# EAGLE design CS43L22-CNZ_withoutAnalog (EAGLE 9.2.0)
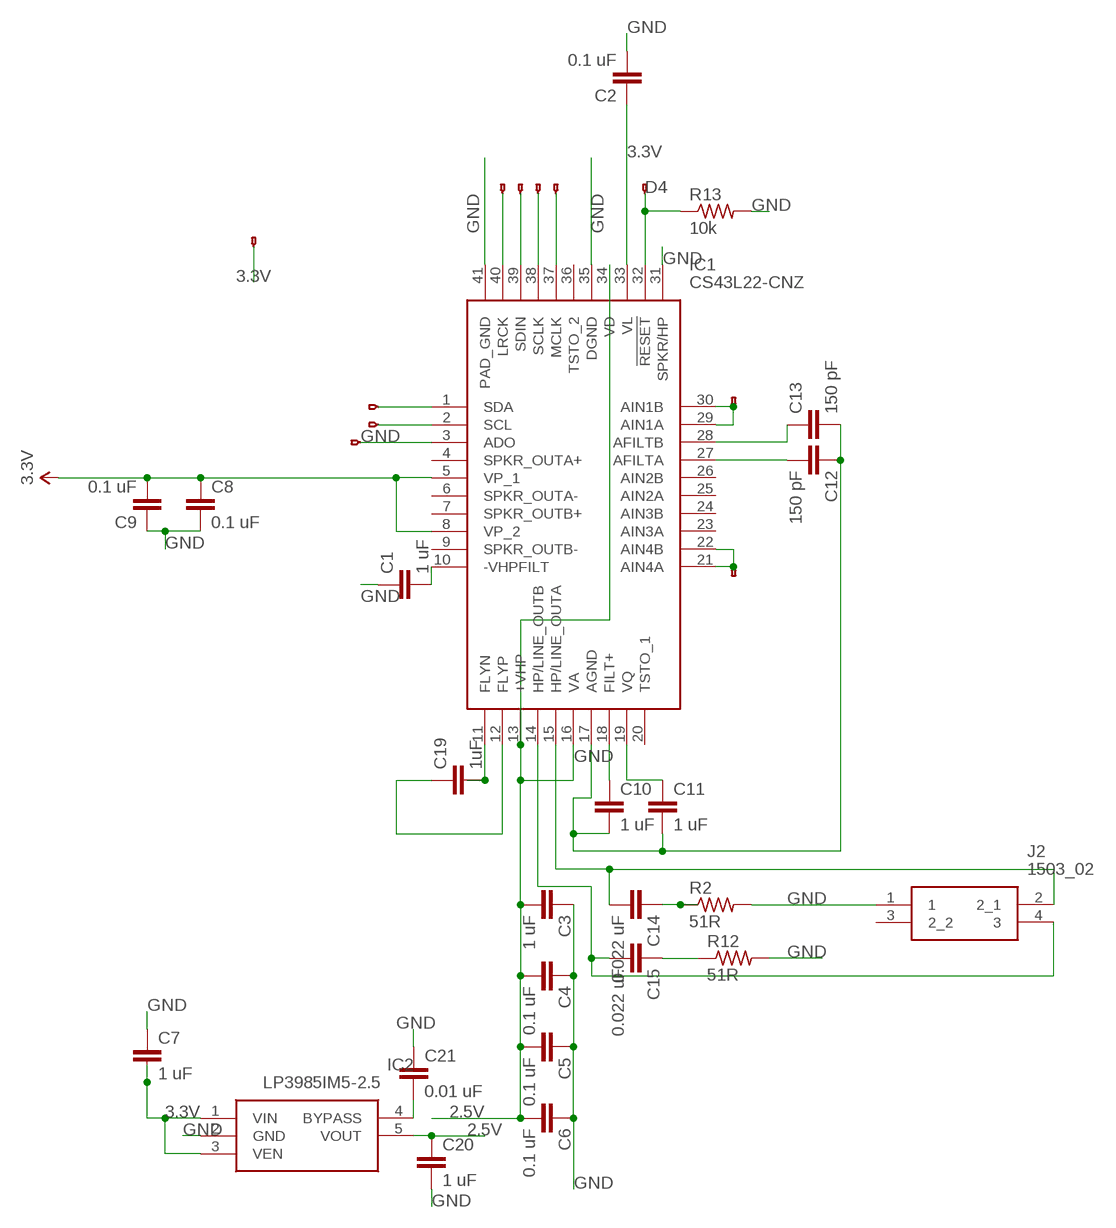
[diagram p0: schematic, sheet 1]

## Parts
C1  1 uF  CAPKIT  [CAP-PTH-SMALL-KIT]
C2  0.1 uF  CAPKIT  [CAP-PTH-SMALL-KIT]
C3  1 uF  CAPKIT  [CAP-PTH-SMALL-KIT]
C4  0.1 uF  CAPKIT  [CAP-PTH-SMALL-KIT]
C5  0.1 uF  CAPKIT  [CAP-PTH-SMALL-KIT]
C6  0.1 uF  CAPKIT  [CAP-PTH-SMALL-KIT]
C7  1 uF  CAPKIT  [CAP-PTH-SMALL-KIT]
C8  0.1 uF  CAPKIT  [CAP-PTH-SMALL-KIT]
C9  0.1 uF  CAPKIT  [CAP-PTH-SMALL-KIT]
C10  1 uF  CAPKIT  [CAP-PTH-SMALL-KIT]
C11  1 uF  CAPKIT  [CAP-PTH-SMALL-KIT]
C12  150 pF  CAPKIT  [CAP-PTH-SMALL-KIT]
C13  150 pF  CAPKIT  [CAP-PTH-SMALL-KIT]
C14  0.022 uF  CAPKIT  [CAP-PTH-SMALL-KIT]
C15  0.022 uF  CAPKIT  [CAP-PTH-SMALL-KIT]
C19  1uF  C2,5-3  [C2.5-3]
C20  1 uF  CAPKIT  [CAP-PTH-SMALL-KIT]
C21  0.01 uF  CAPKIT  [CAP-PTH-SMALL-KIT]
IC1  CS43L22-CNZ  [QFN50P600X600X100-41N]
IC2  LP3985IM5-2.5  [SOT95P300X120-5N]
J2  1503_02  [150302]
JP1  HEADERHOLE-HEADERHOLE  [1X1-HEADER-HOLE]
JP2  HEADERHOLE-HEADERHOLE  [1X1-HEADER-HOLE]
JP3  HEADERHOLE-HEADERHOLE  [1X1-HEADER-HOLE]
JP4  HEADERHOLE-HEADERHOLE  [1X1-HEADER-HOLE]
JP5  HEADERHOLE-HEADERHOLE  [1X1-HEADER-HOLE]
JP6  HEADERHOLE-HEADERHOLE  [1X1-HEADER-HOLE]
JP7  HEADERHOLE-HEADERHOLE  [1X1-HEADER-HOLE]
JP8  HEADERHOLE-HEADERHOLE  [1X1-HEADER-HOLE]
JP9  HEADERHOLE-HEADERHOLE  [1X1-HEADER-HOLE]
JP18  HEADERHOLE-HEADERHOLE  [1X1-HEADER-HOLE]
JP19  HEADERHOLE-HEADERHOLE  [1X1-HEADER-HOLE]
R2  51R  R-US_0204/2V  [0204V]
R12  51R  R-US_0204/2V  [0204V]
R13  10k  R-US_0204/2V  [0204V]

## Nets
2.5V: C3.2 C4.2 C5.2 C6.2 C20.1 IC1.13(+VHP) IC1.16(VA) IC1.34(VD) IC2.5(VOUT)
3.3V: C2.1 C7.2 C8.1 C9.2 IC1.5(VP_1) IC1.8(VP_2) IC1.33(VL) IC2.1(VIN) IC2.3(VEN) JP8.1
D4: IC1.32(!RESET) JP7.1 R13.1
GND: C1.1 C2.2 C3.1 C4.1 C5.1 C6.1 C7.1 C8.2 C9.1 C10.2 C11.2 C12.1 C13.2 C20.2 C21.1 IC1.3(ADO) IC1.17(AGND) IC1.31(SPKR/HP) IC1.35(DGND) IC1.41(PAD_GND) IC2.2(GND) J2.1 JP9.1 R2.2 R12.2 R13.2
N$1: C19.2 IC1.11(FLYN)
N$2: IC1.1(SDA) JP1.1
N$3: IC1.2(SCL) JP2.1
N$4: IC1.37(MCLK) JP3.1
N$5: IC1.38(SCLK) JP4.1
N$6: IC1.39(SDIN) JP5.1
N$7: IC1.40(LRCK) JP6.1
N$8: C21.2 IC2.4(BYPASS)
N$9: C1.2 IC1.10(-VHPFILT)
N$10: C19.1 IC1.12(FLYP)
N$11: C11.1 IC1.19(VQ)
N$13: C12.2 IC1.27(AFILTA)
N$14: C13.1 IC1.28(AFILTB)
N$15: C14.2 IC1.15(HP/LINE_OUTA) J2.2(2_1)
N$16: C10.1 IC1.18(FILT+)
N$17: C15.2 IC1.14(HP/LINE_OUTB) J2.4
N$18: C14.1 R2.1
N$19: C15.1 R12.1
N$31: IC1.29(AIN1A) IC1.30(AIN1B) JP19.1
N$32: IC1.21(AIN4A) IC1.22(AIN4B) JP18.1
Unconnected: IC1.4(SPKR_OUTA+) IC1.6(SPKR_OUTA-) IC1.7(SPKR_OUTB+) IC1.9(SPKR_OUTB-) IC1.20(TSTO_1) IC1.23(AIN3A) IC1.24(AIN3B) IC1.25(AIN2A) IC1.26(AIN2B) IC1.36(TSTO_2) J2.3(2_2)

## Library data of the parts
C1-C15 C20 C21 = F405Pill:CAP: Capacitor Standard 0603 ceramic capacitor, and 0.1" leaded capacitor.
C19 = capacitor-wima:C: CAPACITOR naming: grid - package width
IC1 = CS43L22-CNZ:CS43L22-CNZ: CS43L22-CNZ, Audio DAC 24 bit-, 96ksps Serial, 40-Pin QFN Source: Datasheet <https://d3uzseaevmutz1.cloudfront.net/pubs/proDatasheet/CS43L22_F2.pdf>; DESCRIPTION: CS43L22-CNZ, Audio DAC 24 bit-, 96ksps Serial, 40-Pin QFN; HEIGHT: 1mm; MANUFACTURER_NAME: Cirrus Logic; MANUFACTURER_PART_NUMBER: CS43L22-CNZ; MOUSER_PART_NUMBER: 777-CS43L22-CNZ; MOUSER_PRICE-STOCK: https://www.mouser.com/Search/Refine.aspx?Keyword=777-CS43L22-CNZ; RS_PART_NUMBER: 7165851P; RS_PRICE-STOCK: http://uk.rs-online.com/web/p/products/7165851P
IC2 = LP3985IM5-2.5:LP3985IM5-2.5: Low-Dropout CMOS Voltage Regulator Source: Datasheet; DESCRIPTION: Low-Dropout CMOS Voltage Regulator; HEIGHT: mm; MANUFACTURER_NAME: Texas Instruments; MANUFACTURER_PART_NUMBER: LP3985IM5-2.5; MOUSER_PART_NUMBER: 926-LP3985IM5-25; MOUSER_PRICE-STOCK: https://www.mouser.com/Search/Refine.aspx?Keyword=926-LP3985IM5-25; RS_PART_NUMBER: 4433167; RS_PRICE-STOCK: https://uk.rs-online.com/web/p/products/4433167
J2 = 1503_02:1503_02: LUMBERG - 1503 02 - CONNECTOR, RECEPTACLE, 3.5MM PHONO, 3WAY Source: Datasheet <http://www.farnell.com/datasheets/2047485.pdf>; DESCRIPTION: LUMBERG - 1503 02 - CONNECTOR, RECEPTACLE, 3.5MM PHONO, 3WAY; HEIGHT: 5mm; MANUFACTURER_NAME: LUMBERG; MANUFACTURER_PART_NUMBER: 1503 02
JP1-JP9 JP18 JP19 = F405Pill:HEADERHOLE
R2 R12 R13 = rcl:R-US_: RESISTOR, American symbol; SPICEPREFIX: R

## Net classes
0 default: width 0.254 mm, drill 0.35 mm
1 ground: width 0.254 mm, drill 0.35 mm

## Board
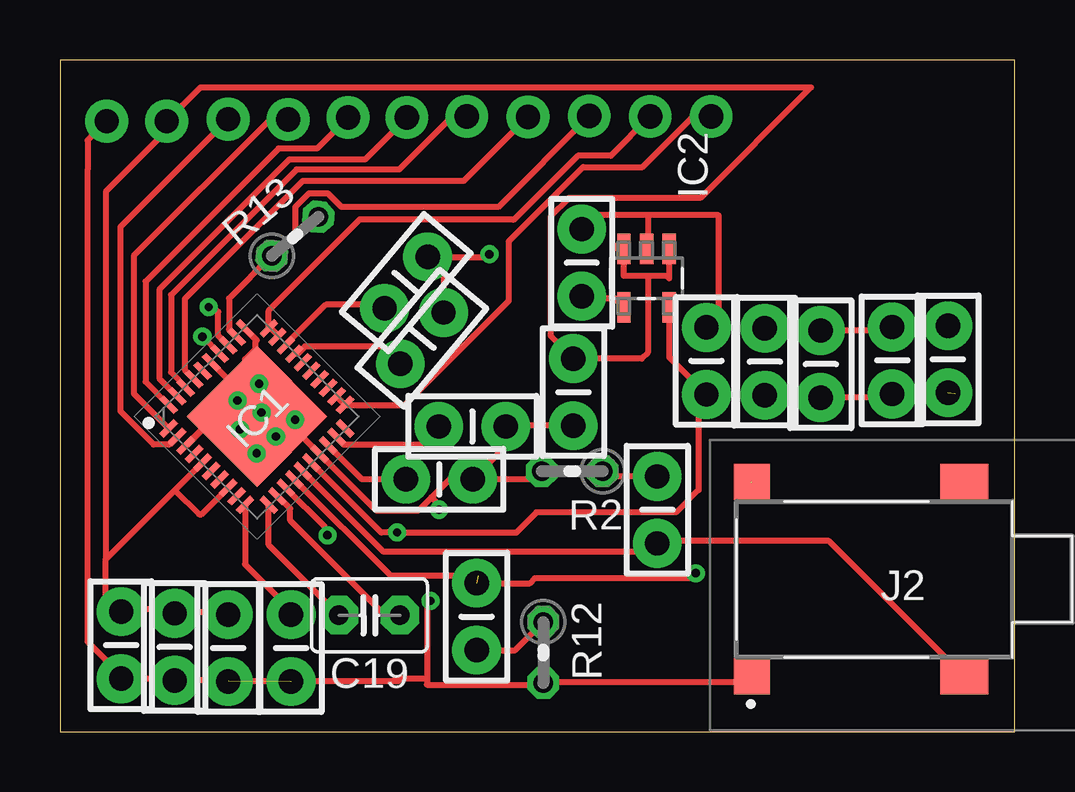
[diagram p1: board, top side]
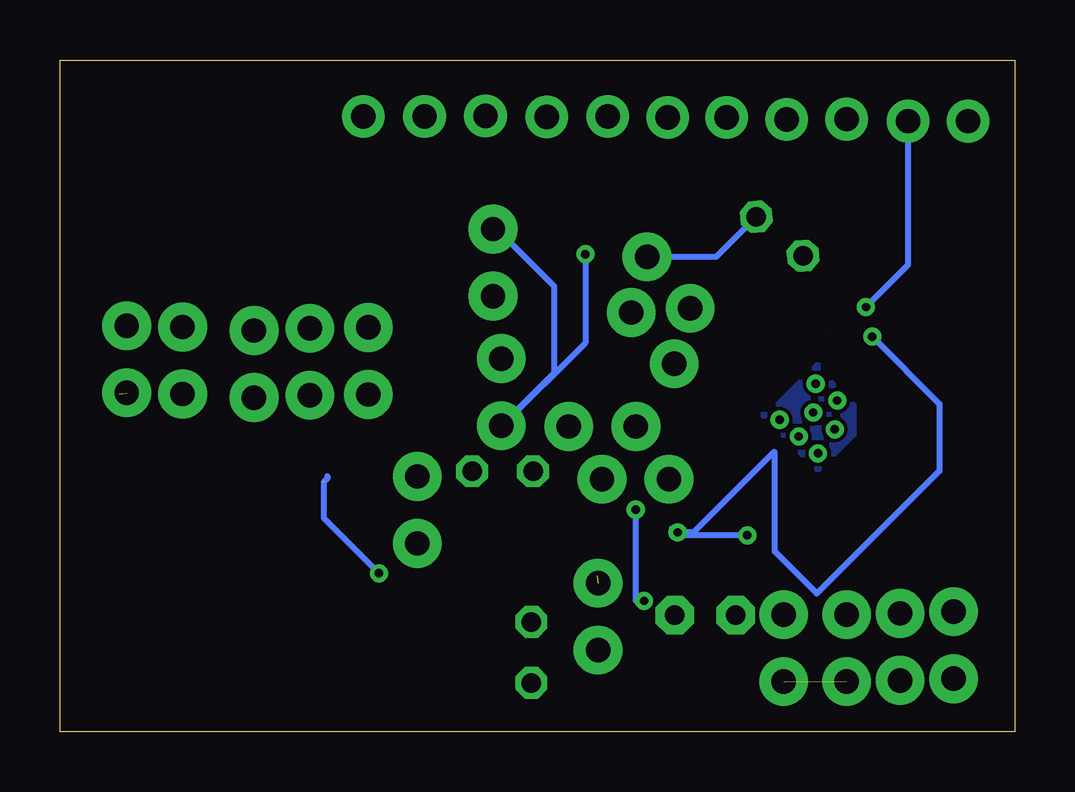
[diagram p2: board, bottom side, seen from below]

Size 39.8 x 28 mm. Coordinates in mm from the lower left corner, seen from the top.
Outline: 0,0 39.8,0 39.8,28 0,28 0,0
Copper layers (1*16): Top 0.035mm / dielectric 1.5mm / Bottom 0.035mm
Design rules "default": minimum track width 6mil, minimum drill 0.35mm, track to track 6mil, track to pad 6mil, pad to pad 6mil, via to via 6mil, smd to smd 6mil, copper to edge 40mil, drill to drill 6mil, minimum pad ring 10mil, minimum via ring 8mil, stop-mask expansion 4mil, vias tented up to drill 0mil, thermal gap 10mil

### Footprints (pad centres in the part's own frame; a part is rotated, then mirrored left to right if it is on the bottom)
CAP-PTH-SMALL-KIT = drill 1.016 pad 2.032: 1 -1.397,0; 2 1.397,0
C2.5-3 = drill 0.813 pad 1.6 octagon: 1 -1.27,0; 2 1.27,0
QFN50P600X600X100-41N = smd 0.85 x 0.25: 1 -2.95,2.25; 2 -2.95,1.75; 3 -2.95,1.25; 4 -2.95,0.75; 5 -2.95,0.25; 6 -2.95,-0.25; 7 -2.95,-0.75; 8 -2.95,-1.25; 9 -2.95,-1.75; 10 -2.95,-2.25; 21 2.95,-2.25; 22 2.95,-1.75; 23 2.95,-1.25; 24 2.95,-0.75; 25 2.95,-0.25; 26 2.95,0.25; 27 2.95,0.75; 28 2.95,1.25; 29 2.95,1.75; 30 2.95,2.25 | smd 0.25 x 0.85: 11 -2.25,-2.95; 12 -1.75,-2.95; 13 -1.25,-2.95; 14 -0.75,-2.95; 15 -0.25,-2.95; 16 0.25,-2.95; 17 0.75,-2.95; 18 1.25,-2.95; 19 1.75,-2.95; 20 2.25,-2.95; 31 2.25,2.95; 32 1.75,2.95; 33 1.25,2.95; 34 0.75,2.95; 35 0.25,2.95; 36 -0.25,2.95; 37 -0.75,2.95; 38 -1.25,2.95; 39 -1.75,2.95; 40 -2.25,2.95 | smd 4.15 x 4.15: 41 0,0
SOT95P300X120-5N = smd 1.27 x 0.559: 1 -1.219,0.94; 2 -1.219,0; 3 -1.219,-0.94; 4 1.219,-0.94; 5 1.219,0.94
150302 = smd 1.5 x 1.5: 1 6.3,3.8; 4 6.3,-4.3 | smd 2 x 1.5: 2 -2.55,3.8; 3 -2.55,-4.3
1X1-HEADER-HOLE = drill 1.016 pad 1.778: 1 0,0
0204V = drill 0.813 octagon: 1 -1.27,0; 2 1.27,0

### Placement (x,y rotation side)
C1  9.63,3.48 90 top
C2  2.55,3.6 270 top
C3  37.02,15.52 270 top
C4  34.69,15.47 270 top
C5  31.71,15.32 270 top
C6  29.38,15.42 270 top
C7  21.4,14.15 90 top
C8  4.78,3.53 270 top
C9  7.01,3.48 90 top
C10  15.81,10.52 0 top
C11  17.19,12.72 0 top
C12  15.09,16.4 230 top
C13  14.43,18.72 50 top
C14  24.9,9.24 270 top
C15  17.37,4.79 90 top
C19  12.9,4.85 180 top
C20  26.95,15.45 90 top
C21  21.75,19.55 270 top
IC1  8.21,13.13 45 top
IC2  24.45,18.9 270 top
J2  35.15,6.1 180 top
JP1  9.51,25.52 0 top
JP2  7.01,25.53 0 top
JP3  19.51,25.63 0 top
JP4  16.96,25.64 0 top
JP5  14.46,25.6 0 top
JP6  12.01,25.61 0 top
JP7  22.06,25.66 0 top
JP8  4.45,25.45 0 top
JP9  1.95,25.45 0 top
JP18  27.15,25.65 0 top
JP19  24.6,25.65 0 top
R2  21.35,10.85 180 top
R12  20.15,3.3 270 top
R13  9.8,20.65 40 top

### Tracks (layer width: path | path; a pad name or v marks a point on that pad's centre or on a via)
2.5V  (via drill 0.35)  (1 unrouted)
  Top 0.254: IC1.13 11.05,8.52 11.05,8.08 v11.15,8.18 | IC1.16 13.39,8.3 v14.05,8.3 19.03,8.3 19.86,9.14 25.69,9.14 26.61,10.06 26.61,13.72 C20.1 | C20.1 29.35,14.05 C6.2 31.61,14.02 C5.2 34.54,13.92 C4.2 37.33,14.07 37.5,13.9 | C20.1 25.39,15.61 IC2.5 | IC1.34 v5.94,16.46
  Bottom 0.254: v11.15,8.18 14.03,8.18 14.15,8.3 | 14.3,8.45 14.15,8.3 | 14.15,8.3 v14.05,8.3 13.4,8.3 10.05,11.65 10,11.65 10,7.5 8.25,5.75 3.14,10.86 3.14,13.66 v5.94,16.46
3.3V  (via drill 0.35)
  Top 0.254: 23.11,20.25 23.38,20.25 23.25,20.12 IC2.3 23.5,19 24.5,19 | 5.95,11.2 IC1.5 4.79,10.06 | IC1.8 5.9,9.05 5.8,9.05 4.79,10.06 | C9.2 6.91,4.98 4.8,4.98 | 4.8,4.98 4.78,4.96 C8.1 | 5.05,5.2 C8.1 | IC1.33 6.6,16.51 6.6,17.5 6.4,17.7 v6.2,17.7 | 4.95,5.1 C8.1 | 4.8,4.98 4.68,5.1 2.65,5.1 C2.1 1.89,5.66 1.89,7.16 1.91,7.18 | 1.91,7.18 4.79,10.06 | 1.91,7.18 1.91,22.51 4.45,25.05 JP8.1 5.86,26.86 31.31,26.86 26.7,22.24 21.21,22.24 20.45,21.48 20.45,16.49 C7.2 24.25,15.55 24.5,15.8 24.5,19 | IC2.1 25.39,18.91 | 25.39,18.91 25.4,18.9 | 25.39,18.91 25.3,19 24.5,19
  Bottom 0.254: v6.2,17.7 4.45,19.45 JP8.1
D4
  Top 0.254: JP7.1 18.27,21.87 11.74,21.87 11.18,22.44 10.37,22.44 9.8,21.87 9.8,20.81 R13.1 7.05,18.05 7.05,16.77 IC1.32
GND  (via drill 0.35)  (2 unrouted)
  Top 0.254: 1.95,25.3 JP9.1 1.15,24.65 1.15,23.43 1.14,23.42 1.14,3.76 2.7,2.2 | C3.1 36.97,16.87 C4.1 34.54,16.72 C5.1 31.61,16.82 C6.1 26.98,16.82 C20.2 27.45,17.35 27.45,21.53 24.5,21.53 | 24.5,21.53 24.5,20.17 IC2.2 | 24.5,21.53 22.32,21.53 C21.1 | 17.24,10.56 18.59,11.9 C11.2 18.62,12.75 C7.1 | 17.24,10.56 C10.2 19.75,10.52 R2.2 | C12.1 15.99,19.13 C13.2 18.01,19.79 v17.9,19.9 | 4.9,2.13 6.96,2.13 C9.1 7.03,2.1 14.1,2.1 14,2.2 15.3,2.2 | 4.9,2.13 C8.2 | J2.1 28.6,2.05 20.17,2.05 R12.2 20.23,1.95 15.3,1.95 15.3,2.2 | 17.24,10.56 16.28,10.56 15.49,9.76 | 15.49,9.76 14.95,9.22 13.18,9.22 IC1.17 9.27,13.13 IC1.41 | 6.19,12.84 5.28,11.93 IC1.3 6.44,13.13 IC1.41 | 8.21,16.31 7.72,16.8 | 15.49,9.76 15.8,9.45 v15.8,9.25 | v15.45,5.45 15.3,5.3 15.3,2.2 | 2.7,2.2 4.83,2.2 4.9,2.13 | 2.7,2.2 C2.2 | IC1.35 8.21,13.48 IC1.41 | IC1.41 8.2,14.4 7.71,14.88 7.71,15.51 8.13,15.93 8.13,16.36 7.71,16.77 IC1.31
  Bottom 0.254: v17.9,19.9 17.9,16.2 21.35,12.75 C7.1 19.2,14.95 19.2,18.57 21.58,20.95 C21.1 | R13.2 12.45,19.79 C13.2 | v15.8,9.25 15.8,5.45 v15.45,5.45
HEAT
  pour Bottom: 8.2,15.3 10.3,13.2 10.5,13.2 8.2,10.9 6.7,12.4 6.7,13.6 8.2,15.1
N$1
  Top 0.254: C19.2 8.71,7.78 IC1.11
N$2
  Top 0.254: IC1.1 3.08,14.09 3.08,19.84 8.76,25.52 JP1.1
N$3
  Top 0.254: IC1.2 4.85,12.28 4.54,11.97 3.9,11.97 2.52,13.36 2.52,21.04 JP2.1
N$4
  Top 0.254: JP3.1 16.83,22.95 10.12,22.95 5.2,18.03 5.2,15.08 IC1.37
N$5
  Top 0.254: JP4.1 16.35,25.64 14.14,23.43 9.86,23.43 4.62,18.2 4.62,14.98 5.24,14.37 IC1.38
N$6
  Top 0.254: IC1.39 4.14,14.73 4.14,18.43 9.56,23.85 12.71,23.85 JP5.1
N$7
  Top 0.254: IC1.40 4.52,13.62 3.57,14.57 3.57,18.77 9.11,24.31 10.71,24.31 JP6.1
N$8
  Top 0.254: C21.2 21.85,18.05 23.14,18.05 IC2.4
N$9
  Top 0.254: IC1.10 7.71,6.97 9.63,5.05 C1.2
N$10
  Top 0.254: C19.1 13.55,4.85 9.6,8.8 9.6,9.3 9.09,9.81 | 9.09,9.81 | 9.09,9.81 IC1.12
N$11
  Top 0.254: IC1.19 11.53,12.27 11.83,11.97 15.04,11.97 C11.1
N$12  (via drill 0.35)
  other vias: 8.3,14.5
N$13
  Top 0.254: C12.2 13.46,16.06 10.22,16.06 9.9,15.75 IC1.27
N$14
  Top 0.254: C13.1 13.38,17.8 11.08,17.8 9.41,16.13 IC1.28
N$15
  Top 0.254: IC1.15 13.49,7.49 24.55,7.49 C14.2 25,7.94 32.06,7.94 J2.2
N$16
  Top 0.254: IC1.18 12.59,10.52 C10.1
N$17  (via drill 0.35)  (2 unrouted)
  Top 0.254: IC1.14 13.8,6.48 17.42,6.48 | v26.5,6.6 26.3,6.4 19.8,6.4 19.59,6.19 C15.2
  Bottom 0.254: 28.65,10.65 28.65,10.55 28.8,10.4 28.8,8.9 v26.5,6.6
N$18
  Top 0.254: R2.1 22.8,11.01 22.8,10.64 C14.1
N$19
  Top 0.254: C15.1 18.97,3.39 R12.1
N$20  (via drill 0.35)
  other vias: 7.4,13.8
N$21  (via drill 0.35)
  other vias: 7.5,12.6
N$22  (via drill 0.35)
  other vias: 8.2,11.6
N$23  (via drill 0.35)
  other vias: 9,12.3
N$24  (via drill 0.35)
  other vias: 9.8,13
N$25  (via drill 0.35)
  other vias: 8.4,13.3
N$31
  Top 0.254: JP19.1 22.96,24.01 21.59,24.01 18.91,21.32 18.91,21.34 12.49,21.34 8.71,17.56 IC1.30 8.8,16.81 9.06,16.55 IC1.29
N$32
  Top 0.254: JP18.1 26.4,25.65 24.29,23.54 21.81,23.54 18.7,20.43 18.7,17.95 14.38,13.62 IC1.21 IC1.22 | IC1.22